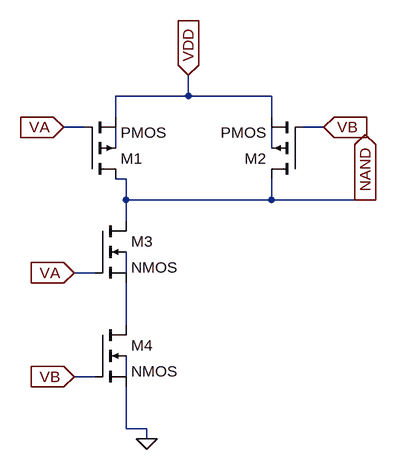
[diagram p0: schematic NAND.asc]
NAND.asc, the LTspice schematic file:
Version 4
SHEET 1 880 680
WIRE 416 112 416 80
WIRE 416 112 304 112
WIRE 544 112 416 112
WIRE 304 144 304 112
WIRE 544 144 544 112
WIRE 256 160 224 160
WIRE 624 160 592 160
WIRE 304 192 304 160
WIRE 544 192 544 160
WIRE 320 240 304 240
WIRE 320 272 320 240
WIRE 544 272 544 240
WIRE 544 272 320 272
WIRE 688 272 544 272
WIRE 704 272 688 272
WIRE 320 304 320 272
WIRE 272 384 240 384
WIRE 320 384 320 352
WIRE 320 464 320 400
WIRE 272 544 240 544
WIRE 320 544 320 512
WIRE 320 624 320 560
WIRE 352 624 320 624
WIRE 352 640 352 624
FLAG 352 640 0
FLAG 416 80 VDD
IOPIN 416 80 In
FLAG 688 272 NAND
IOPIN 688 272 Out
FLAG 624 160 VB
IOPIN 624 160 In
FLAG 224 160 VA
IOPIN 224 160 In
FLAG 240 384 VA
IOPIN 240 384 In
FLAG 240 544 VB
IOPIN 240 544 In
SYMBOL pmos4 256 240 M180
SYMATTR InstName M1
SYMATTR Value2 l=350n w=55u
SYMBOL pmos4 592 240 R180
SYMATTR InstName M2
SYMATTR Value2 l=350n w=55u
SYMBOL nmos4 272 304 R0
SYMATTR InstName M3
SYMATTR Value2 l=350n w=45u
SYMBOL nmos4 272 464 R0
SYMATTR InstName M4
SYMATTR Value2 l=350n w=45u

The netlist it stands for:
* NAND.asc
M1 NAND VA VDD N001 PMOS l=350n w=55u
M2 NAND VB VDD N002 PMOS l=350n w=55u
M3 NAND VA N004 N003 NMOS l=350n w=45u
M4 N004 VB 0 N005 NMOS l=350n w=45u
.model NMOS NMOS
.model PMOS PMOS
.lib standard.mos
.backanno
.end